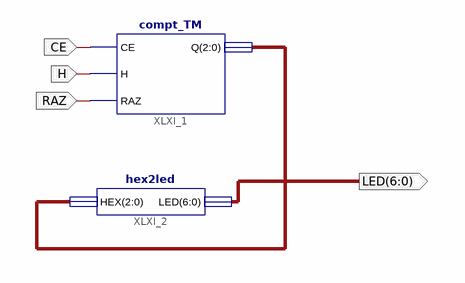
[diagram p0: schematic sheet 1]
// Xilinx ISE schematic compt_top_level_TM.sch (artix7) as structural Verilog: 2 symbols, 4 ports
module compt_top_level_TM (
  input  CE,
  input  H,
  input  RAZ,
  output [6:0] LED
);

  wire [2:0] XLXN_1;

  compt_TM XLXI_1 (.CE(CE), .H(H), .Q(XLXN_1), .RAZ(RAZ));
  hex2led XLXI_2 (.HEX(XLXN_1), .LED(LED));
endmodule
